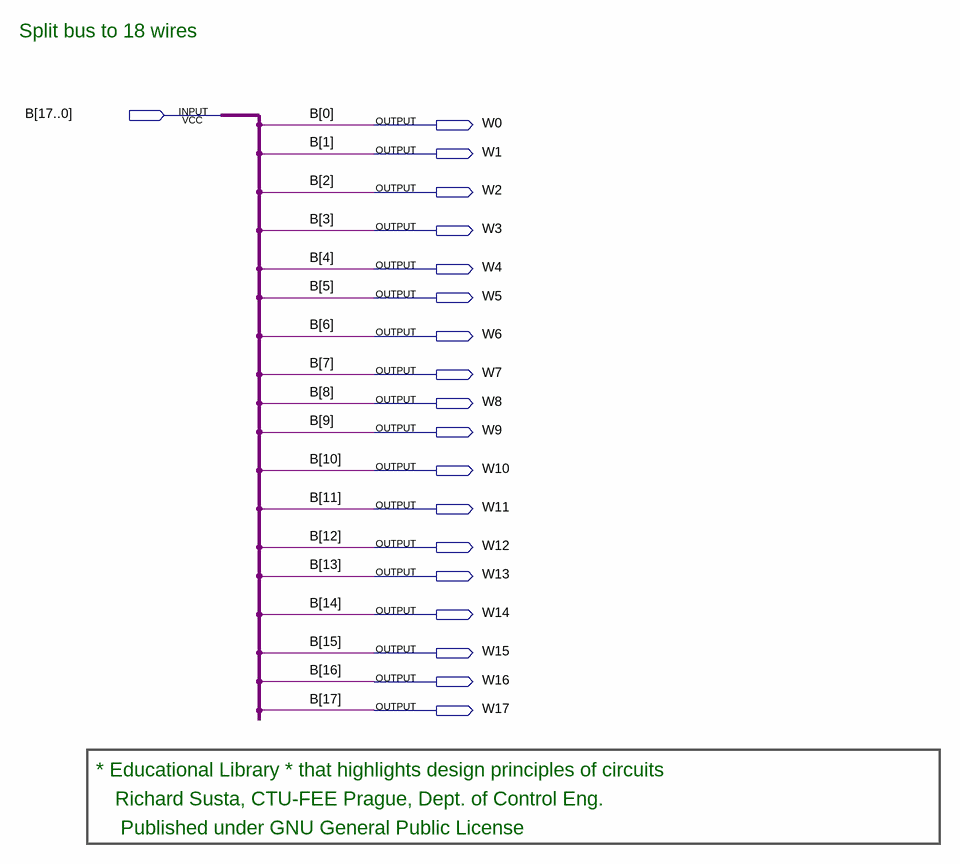
[diagram p0: schematic sheet]
// Quartus schematic split18bus.bdf as structural Verilog: 0 symbols, 19 pins
module split18bus (
  input  [17:0] B,
  output W0,
  output W1,
  output W2,
  output W3,
  output W4,
  output W5,
  output W6,
  output W7,
  output W8,
  output W9,
  output W10,
  output W11,
  output W12,
  output W13,
  output W14,
  output W15,
  output W16,
  output W17
);


  assign W0 = B[0];
  assign W1 = B[1];
  assign W2 = B[2];
  assign W3 = B[3];
  assign W4 = B[4];
  assign W5 = B[5];
  assign W6 = B[6];
  assign W7 = B[7];
  assign W8 = B[8];
  assign W9 = B[9];
  assign W10 = B[10];
  assign W11 = B[11];
  assign W12 = B[12];
  assign W13 = B[13];
  assign W14 = B[14];
  assign W15 = B[15];
  assign W16 = B[16];
  assign W17 = B[17];

  // Notes on the sheet:
  //   Split bus to 18 wires
  //   * Educational Library * that highlights design principles of circuits
  //   Richard Susta, CTU-FEE Prague, Dept. of Control Eng. 
  //    Published under GNU General Public License
endmodule
